# EAGLE design Komplet 0.1 (EAGLE 8.2.0)
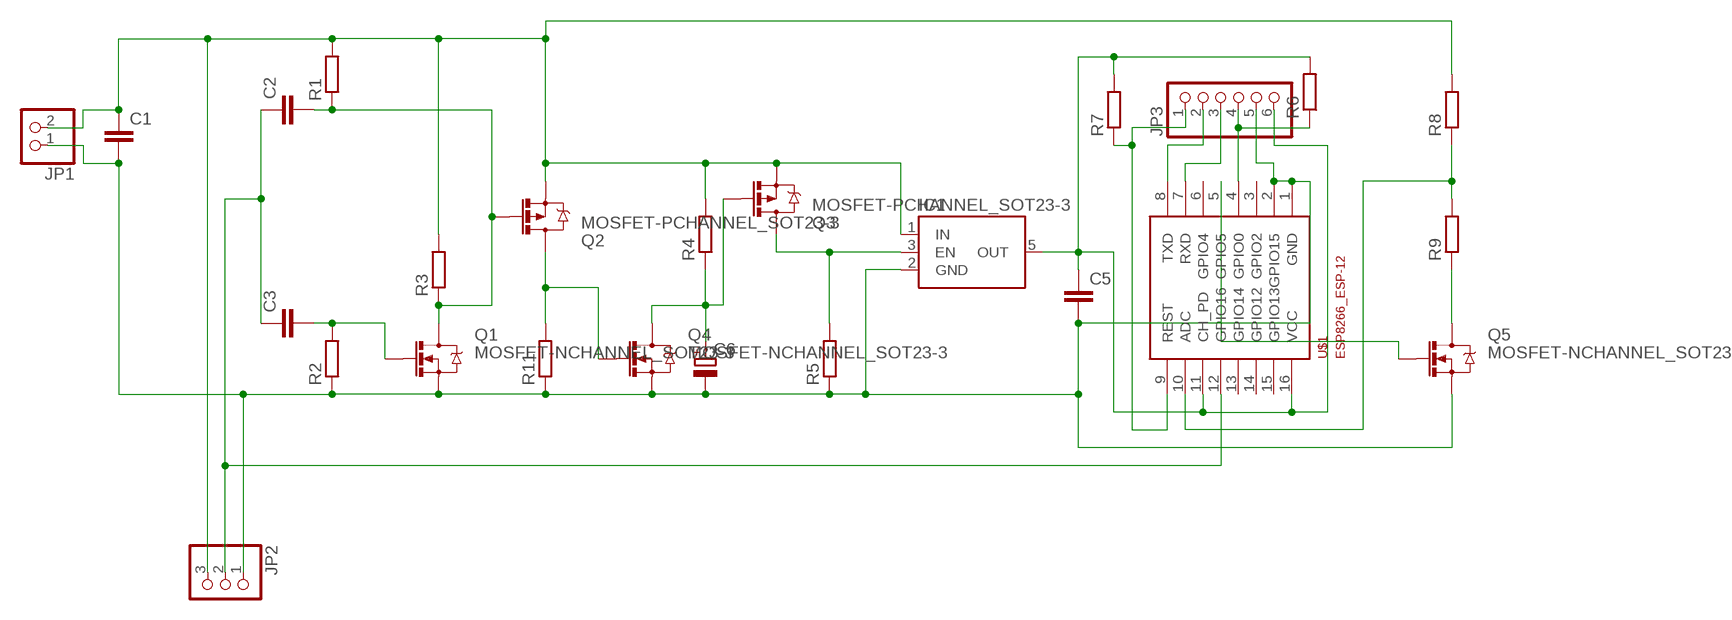
[diagram p0: schematic, sheet 1]

## Parts
C1  C-EUC0805  [C0805]
C2  C-EUC0805  [C0805]
C3  C-EUC0805  [C0805]
C5  C-EUC0805  [C0805]
C6  CPOL-EU153CLV-0807  [153CLV-0807]
IC1  TLV700XX_DDC  [SOT23-5]
JP1  PINHD-1X02_2.54  [1X02]
JP2  PINHD-1X03_2.54  [1X03]
JP3  PINHD-1X06_2.54  [1X06]
Q1  MOSFET-NCHANNEL_SOT23-3  [SOT23-3]
Q2  MOSFET-PCHANNEL_SOT23-3  [SOT23-3]
Q3  MOSFET-PCHANNEL_SOT23-3  [SOT23-3]
Q4  MOSFET-NCHANNEL_SOT23-3  [SOT23-3]
Q5  MOSFET-NCHANNEL_SOT23-3  [SOT23-3]
R1  R-EU_R0805  [R0805]
R2  R-EU_R0805  [R0805]
R3  R-EU_R0805  [R0805]
R4  R-EU_R0805  [R0805]
R5  R-EU_R0805  [R0805]
R6  R-EU_R0805  [R0805]
R7  R-EU_R0805  [R0805]
R8  R-EU_R0805  [R0805]
R9  R-EU_R0805  [R0805]
R11  R-EU_R1206  [R1206]
U$1  ESP8266_ESP-12  [ESP8266-ESP12]

## Nets
3V3: C5.1 IC1.5(OUT) JP3.6 R6.2 R7.2 U$1.11(CH_PD) U$1.16(VCC)
GND: C1.2 C5.2 C6.- IC1.2(GND) JP1.1 JP2.1 JP3.5 Q1.2(S) Q4.2(S) Q5.2(S) R2.1 R5.1 R11.1 U$1.1(GND) U$1.2(GPIO15)
N$1: C6.+ Q3.1(G) Q4.3(D) R4.1
N$4: C2.2 Q1.3(D) Q2.1(G) R1.1 R3.1
N$5: Q2.3(D) Q4.1(G) R11.2
N$6: C3.2 Q1.1(G) R2.2
N$9: Q5.1(G) U$1.5(GPIO5)
N$10: JP3.4 R6.1 U$1.4(GPIO0)
N$11: JP3.3 U$1.7(RXD)
N$12: IC1.3(EN) Q3.3(D) R5.2
N$13: JP3.2 U$1.8(TXD)
N$14: JP3.1 R7.1 U$1.9(REST)
N$16: Q5.3(D) R9.1
N$17: R8.1 R9.2 U$1.10(ADC)
SIGNAL: C2.1 C3.1 JP2.2 U$1.12(GPIO16)
V++: C1.1 IC1.1(IN) JP1.2 JP2.3 Q2.2(S) Q3.2(S) R1.2 R3.2 R4.2 R8.2
Unconnected: U$1.3(GPIO2) U$1.6(GPIO4) U$1.13(GPIO14) U$1.14(GPIO12) U$1.15(GPIO13)

## Library data of the parts
C1-C3 C5 = rcl:C-EU: CAPACITOR, European symbol
C6 = rcl:CPOL-EU: POLARIZED CAPACITOR, European symbol
IC1 = m_vreg:TLV700XX: Texas Instruments 200-mA, Low-IQ, Low-Dropout Regulator for Portable Devices The TLV700xx series of low-dropout (LDO) linear regulators are low quiescent current devices with excellent line and load transient performance. These LDOs are designed for power-sensitive applications. A precision bandgap and error amplifier provides overall 2% accuracy. Low output noise, very high power-supply rejection ratio (PSRR), and low dropout voltage make this series of devices ideal for most battery-operated handheld equipment. All device versions have thermal shutdown and current limit for safety. Furthermore, these devices are stable with an effective output capacitance of only 0.1 µF. This feature enables the use of cost-effective capacitors that have higher bias voltages and temperature derating. The devices regulate to specified accuracy with no output load. The TLV700xx series of LDOs are available in 1,5-mm x 1,5-mm SON-6, SOT23-5, and SC-70 packages. FEATURES Very Low Dropout: 175 mV at 200 mA 2% Accuracy Low IQ: 31 ?A Available in Fixed-Output Voltages from 0.7 V to 4.8 V High PSRR: 68 dB at 1 kHz Stable with Effective Capacitance of 0.1 ?F Thermal Shutdown and Overcurrent Protection Available in 1,5-mm × 1,5-mm SON-6, SOT23-5, and SC-70 packages Octopart <https://octopart.com/search?q=TLV700%3F%3FD*> Updated 2017-01-09; MANUF: TI; PARTNUM: TLV700??DDC?
JP1 = untitled:PINHD-1X02: PIN HEADER
JP2 = untitled:PINHD-1X03: PIN HEADER
JP3 = untitled:PINHD-1X06: PIN HEADER
Q1 Q4 Q5 = Simplex-DiscreteSemi:MOSFET-NCHANNEL: Generic N-channel mosfet
Q2 Q3 = Simplex-DiscreteSemi:MOSFET-PCHANNEL: Generic P-channel mosfet
R1-R9 R11 = rcl:R-EU_: RESISTOR, European symbol
U$1 = ESP8266-ESP12:ESP8266_ESP-12

## Board
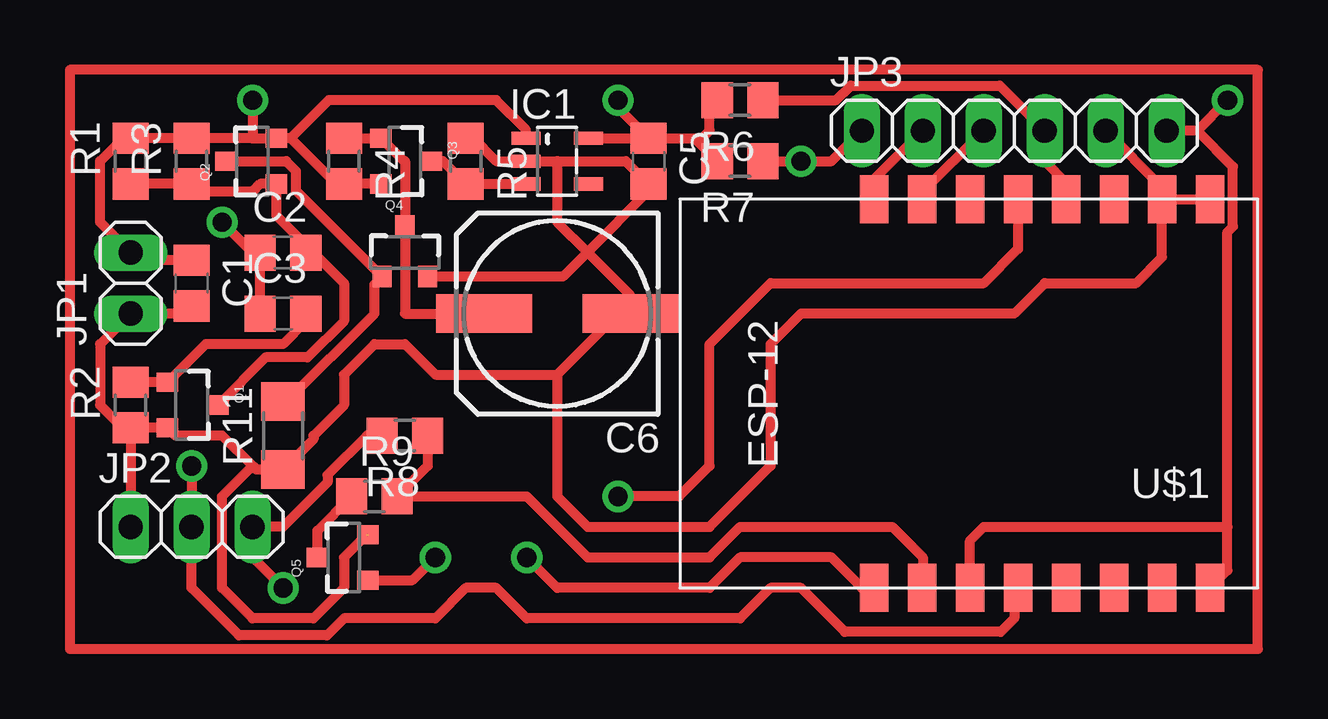
[diagram p1: board, top side]
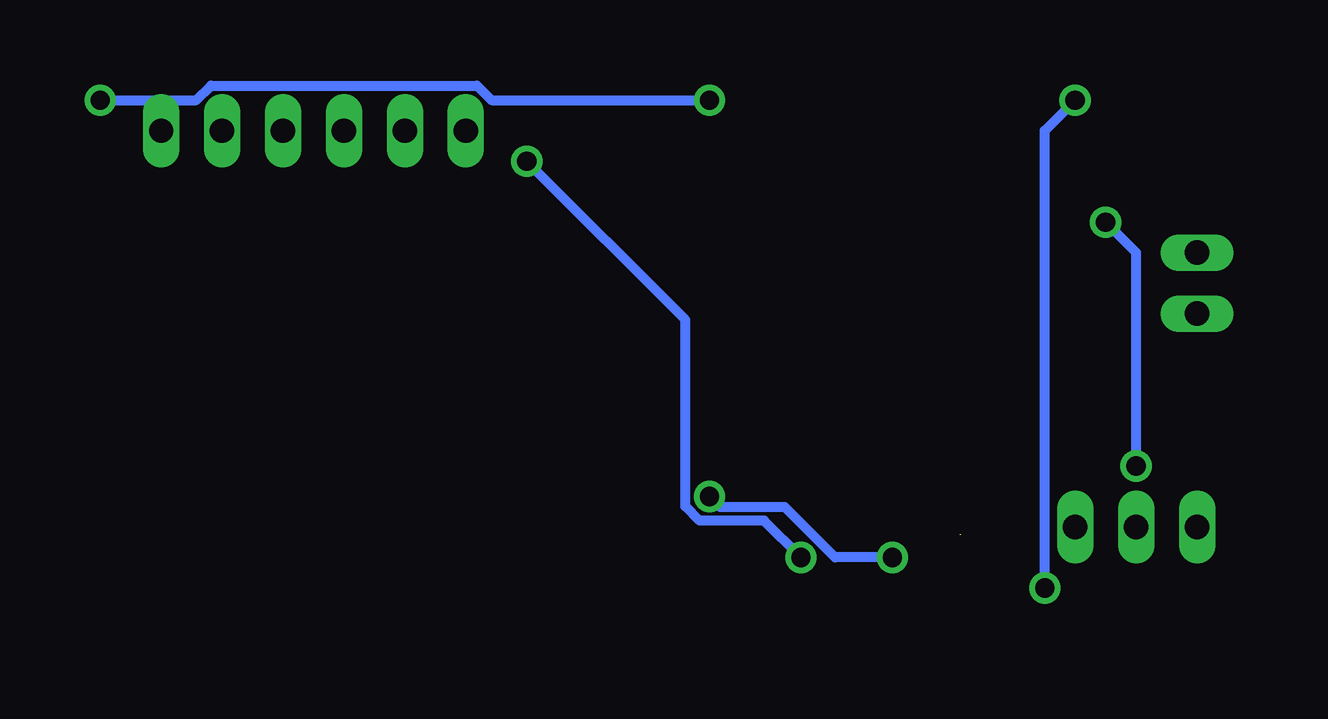
[diagram p2: board, bottom side, seen from below]

No outline drawn. Coordinates in mm, seen from the top.
Copper layers (1*16): Top 0.035mm / dielectric 1.5mm / Bottom 0.035mm
Design rules "default": minimum track width 6mil, minimum drill 0.35mm, track to track 6mil, track to pad 6mil, pad to pad 6mil, via to via 6mil, smd to smd 6mil, copper to edge 40mil, drill to drill 6mil, minimum pad ring 10mil, minimum via ring 8mil, stop-mask expansion 4mil, vias tented up to drill 0mil, thermal gap 10mil

### Footprints (pad centres in the part's own frame; a part is rotated, then mirrored left to right if it is on the bottom)
C0805 = smd 1.3 x 1.5: 1 -0.95,0; 2 0.95,0
153CLV-0807 = smd 4 x 1.6: + 3.05,0; - -3.05,0
SOT23-5 = smd 1.2 x 0.55: 1 -1.3,0.95; 2 -1.3,0; 3 -1.3,-0.95; 4 1.3,-0.95; 5 1.3,0.95
1X02 = drill 1.016 long: 1 -1.27,0; 2 1.27,0
1X03 = drill 1.016 long: 1 -2.54,0; 2 0,0; 3 2.54,0
1X06 = drill 1.016 long: 1 -6.35,0; 2 -3.81,0; 3 -1.27,0; 4 1.27,0; 5 3.81,0; 6 6.35,0
SOT23-3 = smd 0.8 x 0.9: 1 -0.95,-1; 2 0.95,-1; 3 0,1.1
R0805 = smd 1.3 x 1.5: 1 -0.95,0; 2 0.95,0
R1206 = smd 1.6 x 1.803: 1 -1.422,0; 2 1.422,0
ESP8266-ESP12 = smd 2 x 1.2: 1 16.2,2; 2 16.2,4; 3 16.2,6; 4 16.2,8; 5 16.2,10; 6 16.2,12; 7 16.2,14; 8 16.2,16; 9 0,16; 10 0,14; 11 0,12; 12 0,10; 13 0,8; 14 0,6; 15 0,4; 16 0,2

### Placement (x,y rotation side)
C1  8.89,54.61 270 top
C2  12.7,55.88 0 top
C3  12.7,53.34 0 top
C5  27.94,59.69 270 top
C6  24.13,53.34 180 top
IC1  24.13,59.69 0 top
JP1  6.35,54.61 90 top
JP2  8.89,44.45 0 top
JP3  43.18,60.96 0 top
Q1  8.89,49.53 270 top
Q2  11.43,59.69 90 top
Q3  17.78,59.69 270 top
Q4  17.78,55.88 0 top
Q5  15.24,43.18 90 top
R1  6.35,59.69 90 top
R2  6.35,49.53 90 top
R3  8.89,59.69 90 top
R4  15.24,59.69 270 top
R5  20.32,59.69 270 top
R6  31.75,62.23 180 top
R7  31.75,59.69 180 top
R8  17.78,48.26 180 top
R9  16.51,45.72 0 top
R11  12.7,48.26 90 top
U$1  53.34,41.91 90 top

### Tracks (layer width: path | path; a pad name or v marks a point on that pad's centre or on a via)
3V3  (via drill 0.8 pad 1.3)
  Top 0.406: 29.85,60.64 C5.1 27.78,60.8 | 29.85,60.64 R7.2 | 29.85,60.64 30.16,60.64 30.48,60.96 30.48,61.91 R6.2 30.48,62.23 | 52.07,44.45 52.07,42.64 U$1.16 | U$1.11 41.34,43.88 41.91,44.45 52.07,44.45 | 52.07,44.45 52.07,56.74 52.3,56.96 52.3,59.46 50.8,60.96 | 50.8,60.96 JP3.6 | 50.8,60.96 v52.07,62.23 | v26.67,62.23 26.67,61.91 27.78,60.8 | IC1.5 27.62,60.64 27.78,60.8
  Bottom 0.406: v52.07,62.23 48.06,62.23 47.45,62.84 36.37,62.84 35.76,62.23 v26.67,62.23
GND  (1 unrouted)
  Top 0.406: C1.2 8.57,53.34 JP1.1 5.08,52.07 5.08,49.53 6.35,48.26 R2.1 | R2.1 Q1.2 8.21,48.26 10.16,48.26 11.43,46.99 | R2.1 JP2.1 | 11.43,46.99 11.58,46.84 R11.1 13.97,48.11 13.97,48.26 15.24,49.53 15.24,50.8 16.51,52.07 17.78,52.07 19.05,50.8 24.13,50.8 | R5.1 20.64,60.64 21.59,59.69 IC1.2 24.13,59.69 | Q4.2 24.37,54.88 25.39,55.9 | 25.39,55.9 27.94,58.45 | 11.43,46.99 10.16,45.72 10.16,41.91 11.43,40.64 13.97,40.64 15.24,41.91 15.24,43.18 16.19,44.13 | 27.04,59.63 26.99,59.69 | 27.04,59.63 27.05,59.63 | 24.13,59.69 26.99,59.69 | 24.13,59.69 24.13,57.15 25.39,55.9 | 24.13,50.8 24.13,45.72 25.4,44.45 30.48,44.45 33.02,46.99 33.02,52.07 34.29,53.34 43.18,53.34 44.45,54.61 48.26,54.61 49.34,55.69 U$1.2 | 25.39,55.9 27.18,54.1 C6.- 26.67,53.34 24.13,50.8 | U$1.2 U$1.1 | U$1.2 49.34,58.61 JP3.5 | 26.99,59.69 27.04,59.63 | 27.04,59.63 27.05,59.63 | 27.05,59.63 C5.2
N$1
  Top 0.406: 17.78,59.64 Q4.3 17.78,53.34 C6.+ | 17.78,59.64 17.78,59.69 17.78,59.64 | R4.1 Q3.1 17.78,59.64
N$2
  Top 0.406: 3.81,63.5 3.81,39.37 53.34,39.37 53.34,63.5 3.81,63.5
N$4
  Top 0.406: R1.1 R3.1 9.21,58.42 11.43,58.42 11.75,58.74 Q2.1 12.43,57.42 13.81,56.04 C2.2 13.97,55.88 15.24,54.61 15.24,53.03 13.72,51.51 11.97,51.51 Q1.3
N$5
  Top 0.406: Q2.3 12.83,59.69 13.24,59.29 13.24,58.47 Q4.1 16.51,54.56 16.51,53.34 12.85,49.68 R11.2
N$6
  Top 0.406: R2.2 Q1.1 9.48,52.07 10.16,52.07 12.7,52.07 13.65,53.02 C3.2 | R2.2 6.35,50.8 R2.2
N$9  (via drill 0.8 pad 1.3)
  Top 0.406: U$1.5 43.34,56.04 41.91,54.61 33.02,54.61 30.48,52.07 30.48,46.99 29.21,45.72 v26.67,45.72 | Q5.1 18.1,42.23 v19.05,43.18
  Bottom 0.406: v26.67,45.72 26.22,45.27 23.53,45.27 21.44,43.18 v19.05,43.18
N$10
  Top 0.406: U$1.4 45.34,58.8 44.45,59.69 JP3.4 42.57,62.84 36.37,62.84 35.76,62.23 R6.1
N$11
  Top 0.406: U$1.7 39.34,58.39 JP3.3
N$12
  Top 0.406: IC1.3 R5.2 19.43,59.63 19.42,59.63 19.37,59.69 Q3.3
N$13
  Top 0.406: 37.34,57.66 U$1.8 37.34,58.93 JP3.2
N$14  (via drill 0.8 pad 1.3)
  Top 0.406: U$1.9 36.83,41.91 35.56,43.18 31.75,43.18 30.48,41.91 24.13,41.91 v22.86,43.18 | R7.1 v34.29,59.69 35.56,59.69 JP3.1
  Bottom 0.406: v22.86,43.18 24.39,44.71 27.09,44.71 27.68,45.3 27.68,53.08 v34.29,59.69
N$16
  Top 0.406: Q5.3 14.14,44.3 R9.1
N$17
  Top 0.406: R8.1 18.73,46.99 R9.2 | 17.78,45.4 R9.2 | R9.2 22.86,45.72 25.4,43.18 30.48,43.18 31.75,44.45 38.1,44.45 39.37,43.18 39.37,41.94 U$1.10
SIGNAL  (via drill 0.35, 0.8 pad 1.3)
  Top 0.406: 11.43,55.88 C2.1 | 11.43,55.88 v10.16,57.15 | C3.1 11.75,55.56 11.43,55.88 | v8.89,46.99 JP2.2 8.89,41.91 10.87,39.93 14.53,39.93 15.24,40.64 19.05,40.64 20.32,41.91 21.59,41.91 22.86,40.64 31.75,40.64 33.02,41.91 34.29,41.91 36.12,40.08 42.62,40.08 43.18,40.64 43.18,41.75 U$1.12
  Bottom 0.406: v8.89,46.99 8.89,55.88 v10.16,57.15
V++  (via drill 0.8 pad 1.3)
  Top 0.406: 8.89,55.88 C1.1 6.67,55.56 JP1.2 5.08,57.15 5.08,59.69 6.35,60.96 R1.2 R3.2 11.43,60.64 | 16.46,58.74 16.51,58.69 16.73,58.69 Q3.2 R4.2 15.08,58.58 | 11.43,60.64 Q2.2 13.02,60.64 | 15.08,58.58 13.02,60.64 | 15.08,58.58 15.24,58.42 | IC1.1 22.83,60.99 21.59,62.23 14.61,62.23 13.02,60.64 | R8.2 16.2,48.26 14.55,46.62 14.55,46.3 12.7,44.45 JP2.3 11.43,43.18 v12.7,41.91 | v11.43,62.23 11.43,60.64
  Bottom 0.406: v12.7,41.91 12.7,60.96 v11.43,62.23